# Altium schematic sheet AMS1084.SchDoc
size 292 x 193 mm; Author: Power Lin; SheetNumber: 1; SheetTotal: 1; Website: wiki-power.com
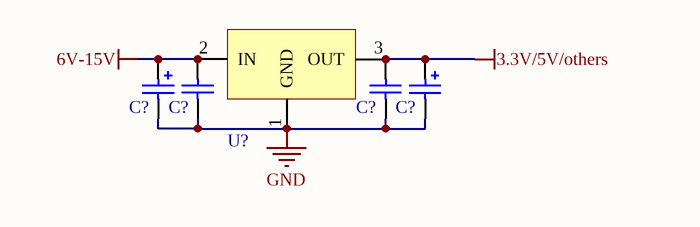
[diagram p0: AMS1084.SchDoc]

## Parts
(Parts that share a designator on the sheet are numbered #1, #2 ... from top to bottom, then left to right.)
C?#1  470uF/50V  [CAP-AUX-3216]  (value not drawn)
C?#2  220uF/10V  [CAP-AUX-3216]  (value not drawn)
C?#3  100nF  [CAP-0603]  (value not drawn)
C?#4  100nF  [CAP-0603]  (value not drawn)
U?  AMS1084CD  [TO-252]  (value not drawn)

## Nets
3.3V/5V/others: C?#2.1 C?#4.2 U?.3(OUT)
6V-15V: C?#1.1 C?#3.2 U?.2(IN)
GND: C?#1.2 C?#2.2 C?#3.1 C?#4.1 U?.1(GND)

## Notes on the sheet
- Author
- DocumentName
- ModifiedDate
- ProjectName
- SheetNumber
- SheetTotal
- Website
- Revision

## Library data of the parts
C?#1 C?#2 = CAP-POL: 贴片电容-有极性; ComponentLink1Description: 供应商链接; ComponentLink1URL: http://www.szlcsc.com/product/details_16815.html; Package: 3528; Supplier: LC; SuppliersPartNumber: C16133
C?#3 C?#4 = CAP: 贴片电容; ComponentLink1Description: 供应商链接; ComponentLink1URL: http://www.szlcsc.com/product/details_53938.html; Package: 0402; Supplier: LC; SuppliersPartNumber: C52923
U? = AMS1084CD: 固定稳压输出（TO-252）